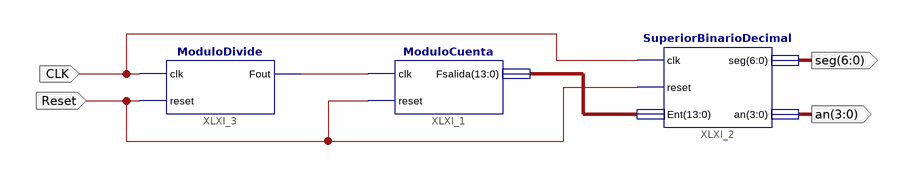
[diagram p0: schematic sheet 1]
// Xilinx ISE schematic SuperiorContadorDisplayVer2.sch (spartan6) as structural Verilog: 3 symbols, 4 ports
module SuperiorContadorDisplayVer2 (
  input  CLK,
  input  Reset,
  output [6:0] seg,
  output [3:0] an
);

  wire XLXN_9;
  wire [13:0] XLXN_3;

  ModuloDivide XLXI_3 (.clk(CLK), .reset(Reset), .Fout(XLXN_9));
  ModuloCuenta XLXI_1 (.clk(XLXN_9), .reset(Reset), .Fsalida(XLXN_3));
  SuperiorBinarioDecimal XLXI_2 (.clk(CLK), .reset(Reset), .Ent(XLXN_3), .seg(seg), .an(an));
endmodule
